# EAGLE design nRF52810_qcaa_dcdc (EAGLE 8.3.0)
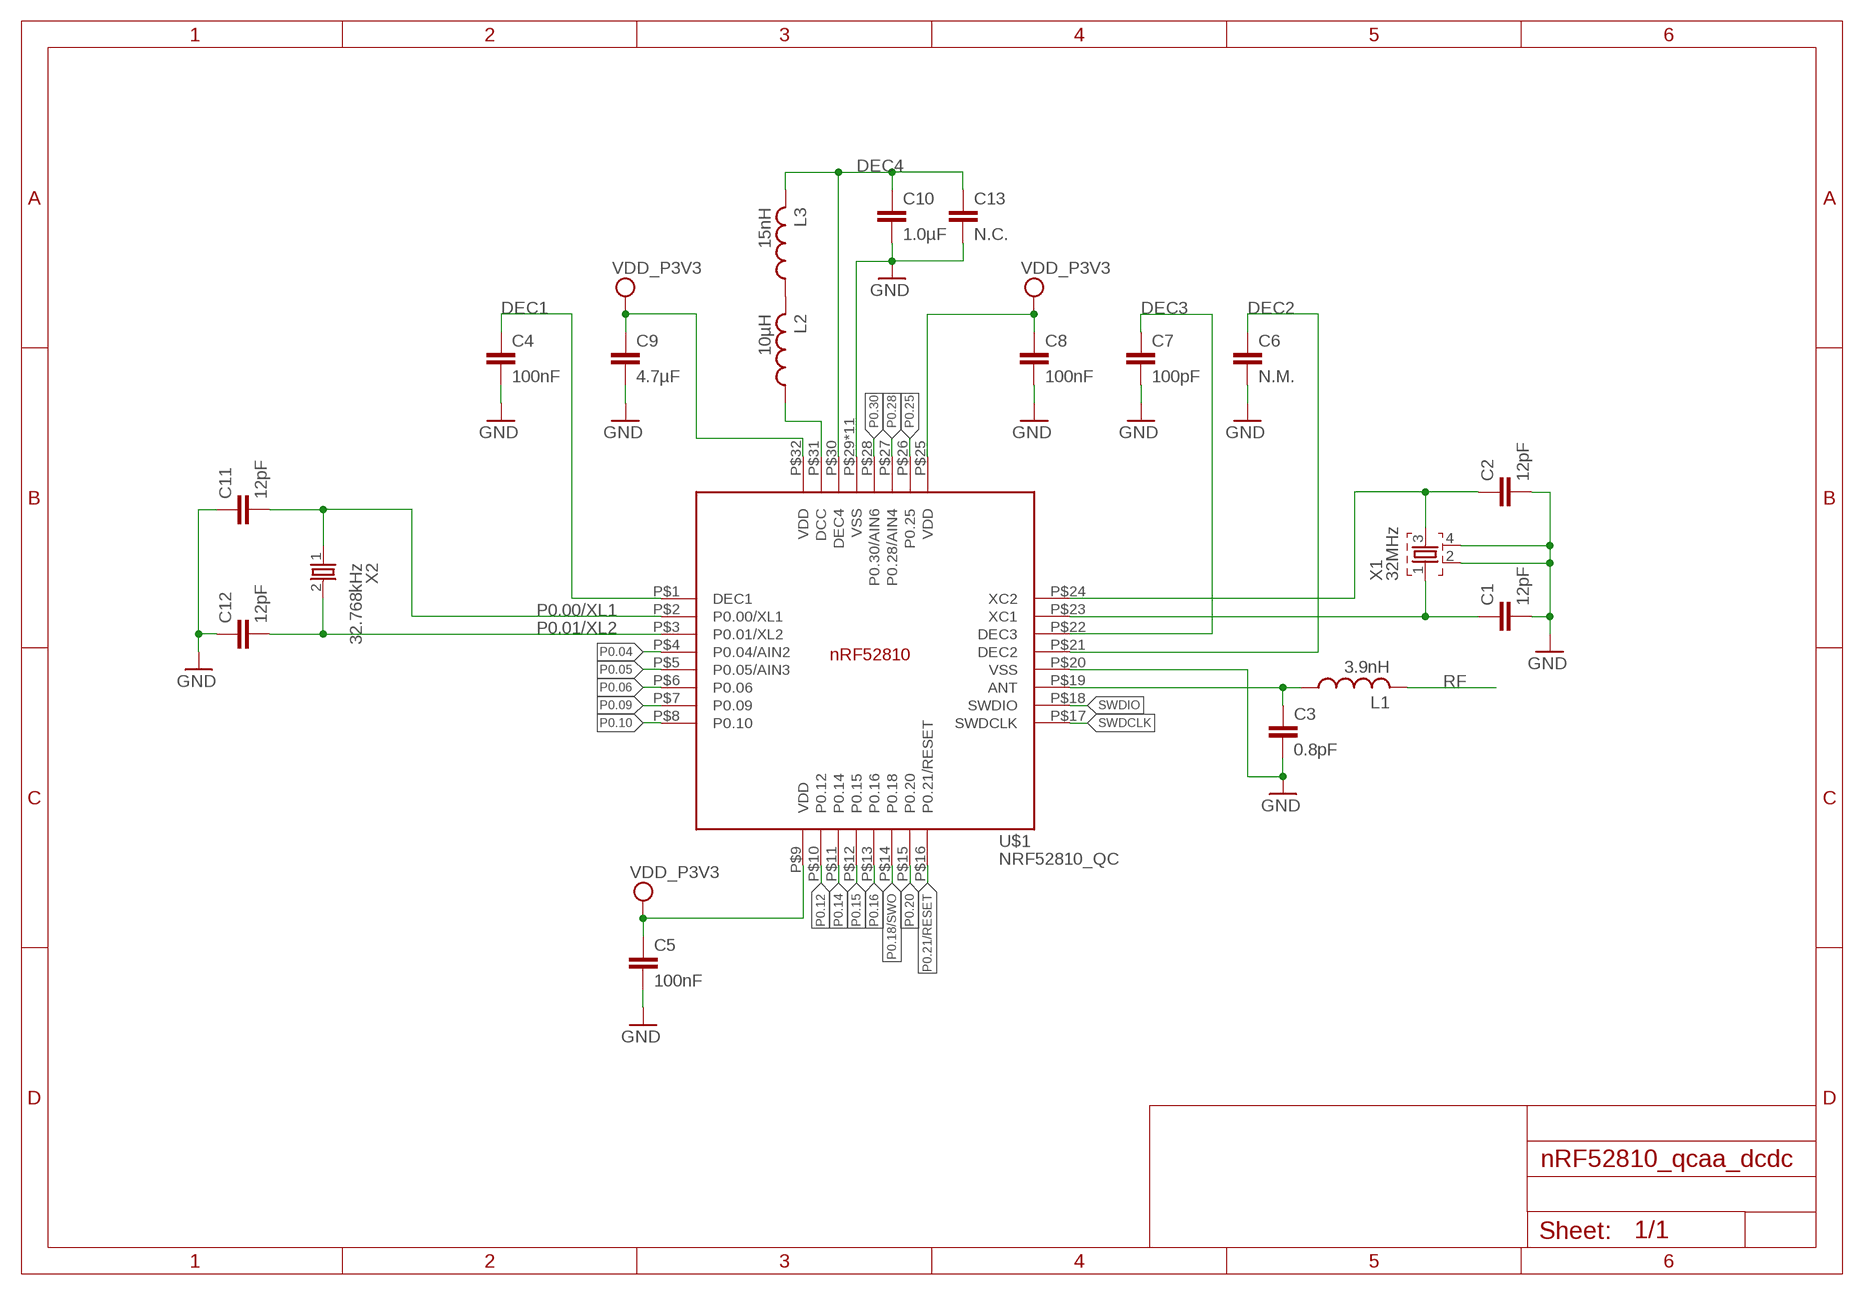
[diagram p0: schematic, sheet 1]

## Parts
C1  12pF  CAPACITOR_0402_N  [RESC0402_N]
C2  12pF  CAPACITOR_0402_N  [RESC0402_N]
C3  0.8pF  CAPACITOR_0402_N  [RESC0402_N]
C4  100nF  CAPACITOR_0402_N  [RESC0402_N]
C5  100nF  CAPACITOR_0402_N  [RESC0402_N]
C6  N.M.  CAPACITOR_0402_N  [RESC0402_N]
C7  100pF  CAPACITOR_0402_N  [RESC0402_N]
C8  100nF  CAPACITOR_0402_N  [RESC0402_N]
C9  4.7µF  CAPACITOR_0603_N  [RESC0603_N]
C10  1.0µF  CAPACITOR_0603_N  [RESC0603_N]
C11  12pF  CAPACITOR_0402_N  [RESC0402_N]
C12  12pF  CAPACITOR_0402_N  [RESC0402_N]
C13  N.C.  CAPACITOR_0402_N  [RESC0402_N]
L1  3.9nH  INDUCTOR_0402_N  [RESC0402_N]
L2  10µH  INDUCTOR_0603_N  [RESC0603_N]
L3  15nH  INDUCTOR_0402_N  [RESC0402_N]
U$1  NRF52810_QC  [QFN50P500X500X90-32_N]
X1  32MHz  XTAL_32MHZ  [BT-XTAL_2016_N]
X2  32.768kHz  XTAL_32KHZ  [XTAL_3215_N]

## Nets
ANT: C3.1 L1.1 U$1.P$19(ANT)
DEC1: C4.1 U$1.P$1(DEC1)
DEC2: C6.1 U$1.P$21(DEC2)
DEC3: C7.1 U$1.P$22(DEC3)
DEC4: C10.1 C13.1 L3.2 U$1.P$30(DEC4)
GND: C1.2 C2.2 C3.2 C4.2 C5.2 C6.2 C7.2 C8.2 C9.2 C10.2 C11.1 C12.1 C13.2 U$1.P$20(VSS) U$1.P$29(VSS) U$1.P$33(VSS) U$1.P$34(VSS) U$1.P$35(VSS) U$1.P$36(VSS) U$1.P$37(VSS) U$1.P$38(VSS) U$1.P$39(VSS) U$1.P$40(VSS) U$1.P$41(VSS) U$1.P$42(VSS) X1.2 X1.4
N$2: L2.2 L3.1
N$3: C2.1 U$1.P$24(XC2) X1.3
N$4: L2.1 U$1.P$31(DCC)
P0.00/XL1: C11.2 U$1.P$2(P0.00/XL1) X2.1
P0.01/XL2: C12.2 U$1.P$3(P0.01/XL2) X2.2
P0.04: U$1.P$4(P0.04/AIN2)
P0.05: U$1.P$5(P0.05/AIN3)
P0.06: U$1.P$6(P0.06)
P0.09: U$1.P$7(P0.09)
P0.10: U$1.P$8(P0.10)
P0.12: U$1.P$10(P0.12)
P0.14: U$1.P$11(P0.14)
P0.15: U$1.P$12(P0.15)
P0.16: U$1.P$13(P0.16)
P0.18/SWO: U$1.P$14(P0.18)
P0.20: U$1.P$15(P0.20)
P0.21/RESET: U$1.P$16(P0.21/RESET)
P0.25: U$1.P$26(P0.25)
P0.28: U$1.P$27(P0.28/AIN4)
P0.30: U$1.P$28(P0.30/AIN6)
RF: L1.2
SWDCLK: U$1.P$17(SWDCLK)
SWDIO: U$1.P$18(SWDIO)
VDD_P3V3: C5.1 C8.1 C9.1 U$1.P$9(VDD) U$1.P$25(VDD) U$1.P$32(VDD)
X1: C1.1 U$1.P$23(XC1) X1.1

## Library data of the parts
C1-C13 = Nordic_nRF:CAPACITOR: Generic chip capacitor
L1-L3 = Nordic_nRF:INDUCTOR: Generic chip inductor
U$1 = Nordic_nRF:NRF52810_QC: nRF52810 Features Single chip, highly flexible, 2.4 GHz multi-protocol SoC 32-bit ARM Cortex-M4 Processor 1.7v to 3.6v operation 192kB flash + 24kB RAM Supports concurrent Bluetooth low energy/ANT protocol operation Up to +4dBm output power -96dBm sensitivity, Bluetooth low energy Thread safe and run-time protected Event driven API On air compatible with nRF24L and nRF24AP series 2 data rates (2Mbps/1Mbps) PPI - maximum flexibility for power-efficient applications and code simplification Automated power management system with automatic power management of each peripheral Configurable I/O mapping for analog and digital I/O 1 x Master/Slave SPI 1 x Two-wire interface (I²C) UART (RTS/CTS) 1 x PWM (4 channels) AES HW encryption 8-channel 10/12-bit ADC Quadrature decoder 64-level analog comparator Real Time Counter (RTC) Digital microphone interface (PDM) On-chip balun Applications Bluetooth 5 connectivity processor Industrial sensors and actuators Wearables SmartHome sensors computer peripherals RF smart remotes Airfuel (A4WP) wireless charging Beacons Sports and fitness sensors Connected health products Smart watches RC Toys Interactive games Building automation
X1 = Nordic_nRF:XTAL_32MHZ
X2 = Nordic_nRF:XTAL_32KHZ

## Board
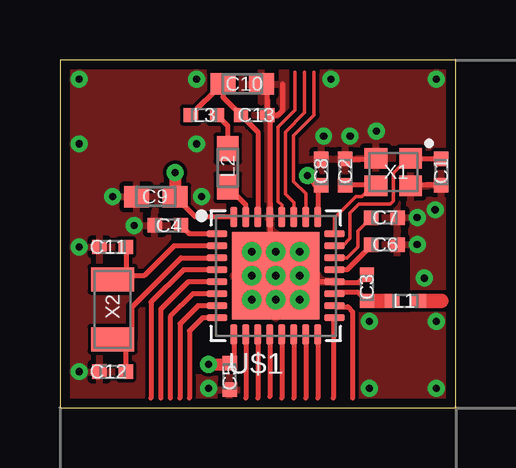
[diagram p1: board, top side]
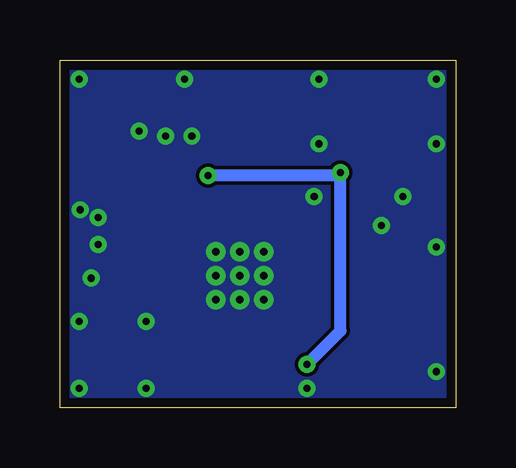
[diagram p2: board, bottom side, seen from below]

Size 16.5 x 14.5 mm. Coordinates in mm from the lower left corner, seen from the top.
Outline: 0,0 16.5,0 16.5,14.5 0,14.5 0,0
Copper layers (1*16): Top 0.035mm / dielectric 1.5mm / Bottom 0.035mm
Design rules "Nordic": minimum track width 0.15mm, minimum drill 0.4mm, track to track 0.15mm, track to pad 0.15mm, pad to pad 0.15mm, via to via 0.15mm, smd to smd 0.15mm, copper to edge 0.4mm, drill to drill 0.4mm, minimum pad ring 10mil, minimum via ring 8mil, stop-mask expansion 4mil, vias tented up to drill 0mil, thermal gap 0.2mm
tRestrict: area 11.8,4 to 14.6,6.3

### Footprints (pad centres in the part's own frame; a part is rotated, then mirrored left to right if it is on the bottom)
RESC0402_N = smd 0.6 x 0.6: 1 -0.55,0; 2 0.55,0
RESC0603_N = smd 1.05 x 0.9: 1 -0.8,0; 2 0.8,0
QFN50P500X500X90-32_N = smd 0.85 x 0.3: P$1 -2.45,1.75; P$2 -2.45,1.25; P$3 -2.45,0.75; P$4 -2.45,0.25; P$5 -2.45,-0.25; P$6 -2.45,-0.75; P$7 -2.45,-1.25; P$8 -2.45,-1.75; P$17 2.45,-1.75; P$18 2.45,-1.25; P$19 2.45,-0.75; P$20 2.45,-0.25; P$21 2.45,0.25; P$22 2.45,0.75; P$23 2.45,1.25; P$24 2.45,1.75 | smd 0.3 x 0.85: P$9 -1.75,-2.45; P$10 -1.25,-2.45; P$11 -0.75,-2.45; P$12 -0.25,-2.45; P$13 0.25,-2.45; P$14 0.75,-2.45; P$15 1.25,-2.45; P$16 1.75,-2.45; P$25 1.75,2.45; P$26 1.25,2.45; P$27 0.75,2.45; P$28 0.25,2.45; P$29 -0.25,2.45; P$30 -0.75,2.45; P$31 -1.25,2.45; P$32 -1.75,2.45 | smd 3.65 x 3.65: P$33 0,0 | drill 0.3 pad 0.6: P$34 -1,1; P$35 0,1; P$36 1,1; P$37 -1,0; P$38 0,0; P$39 1,0; P$40 -1,-1; P$41 0,-1; P$42 1,-1
BT-XTAL_2016_N = smd 0.95 x 0.85: 1 -0.725,-0.575; 2 0.725,-0.575; 3 0.725,0.575; 4 -0.725,0.575
XTAL_3215_N = smd 1 x 1.8: 1 -1.25,0; 2 1.25,0

### Placement (x,y rotation side)
C1  15.9,9.82 270 top
C2  11.9,9.82 90 top
C3  12.8,5 90 top
C4  4.5,7.6 180 top
C5  7.08,1.3 270 top
C6  13.53,6.8 0 top
C7  13.53,7.92 0 top
C8  10.9,9.82 90 top
C9  4,8.8 180 top
C10  7.6,13.5 0 top
C11  2.2,6.7 0 top
C12  2.2,1.5 0 top
C13  8.1,12.2 0 top
L1  14.4,4.45 0 top
L2  7,10 90 top
L3  6,12.2 180 top
U$1  9,5.5 0 top
X1  13.9,9.82 180 top
X2  2.2,4.1 270 top

### Tracks (layer width: path | path; a pad name or v marks a point on that pad's centre or on a via)
ANT
  Top 0.152: 11.5,4.8 U$1.P$19
  Top 0.2: 12.85,4.45 C3.1 12.45,4.8 11.5,4.8
  Top 0.6: L1.1 12.85,4.45
DEC1
  Top 0.2: U$1.P$1 5.4,7.25 C4.1
DEC2
  Top 0.2: C6.1 12.97,6.75 11.97,5.75 U$1.P$21
DEC3
  Top 0.15: U$1.P$22 11.97,6.25 12.43,6.7 12.43,7.38 C7.1
  Top 0.2: C7.1 12.97,7.88
DEC4
  Top 0.2: L3.2 6.75,13.5 C10.1 6.8,12.95 C13.1 8.25,11.5 U$1.P$30
GND  (via drill 0.3 pad 0.6)
  Top 0.152: 11.5,5.2 U$1.P$20
  Top 0.2: C3.2 12.45,5.2 11.5,5.2 | C1.2 14.65,9.28 X1.4 | C2.2 13.15,10.38 X1.2 | 8.75,7.85 U$1.P$29 | 8.75,7.85 8.75,6.5 U$1.P$35 | U$1.P$20 10.25,5.25 arc-90 U$1.P$39 | C13.2 8.75,12.2 8.75,7.85 | C13.2 8.65,13.25 C10.2 | C13.2 9.1,12.2 9.3,12.4 9.3,13.5
  other vias: 0.8,1.5 0.8,6.7 3.1,7.6 11,11.32 14.9,7.92 14.9,6.8 2.2,8.8 15.65,8.25 13.2,11.53 12.1,11.32 0.8,11 6.2,0.8 15.7,3.6 15.2,5.4 5.7,13.7 5.7,11 15.7,13.7 12.9,3.6 15.7,0.8 12.9,0.8 0.8,13.7 11.3,13.7 5.9,8.8
  pour Top: 0,0 0,14.5 16.5,14.5 16.5,0
  pour Bottom: 0,0 0,14.5 16.5,14.5 16.5,0
N$2
  Top 0.2: L2.2 7,11.75 L3.1
N$3
  Top 0.15: X1.3 13.05,9.25 12.6,8.8 12.35,8.8 11.45,7.9 U$1.P$24
  Top 0.2: C2.1 13.1,9.28 13.15,9.28 X1.3
N$4
  Top 0.2: U$1.P$31 7.75,8.45 7.4,8.8 7.1,8.8 L2.1
P0.00/XL1
  Top 0.2: X2.1 2.7,5.45 | C11.2 2.75,5.5 | 2.75,5.5 X2.1 | U$1.P$2 4.75,6.75 3.5,5.5 2.75,5.5 | 2.75,5.5 2.35,5.5 X2.1
P0.01/XL2
  Top 0.2: C12.2 2.75,2.85 X2.2 3,2.85 3,4.2 5.05,6.25 U$1.P$3
P0.04
  Top 0.2: U$1.P$4 5.15,5.75 3.8,4.4 3.8,0.4
P0.05
  Top 0.2: U$1.P$5 5.35,5.25 4.2,4.1 4.2,0.4
P0.06
  Top 0.2: U$1.P$6 5.55,4.75 4.6,3.8 4.6,0.4
P0.09
  Top 0.2: U$1.P$7 5.75,4.25 5,3.5 5,0.4
P0.10
  Top 0.2: U$1.P$8 5.95,3.75 5.4,3.2 5.4,0.4
P0.12
  Top 0.2: U$1.P$10 7.75,0.4
P0.14
  Top 0.2: U$1.P$11 8.25,0.4
P0.15
  Top 0.2: U$1.P$12 8.75,0.45
P0.16
  Top 0.2: U$1.P$13 9.25,0.4
P0.18/SWO
  Top 0.2: U$1.P$14 9.75,0.4
P0.20
  Top 0.2: U$1.P$15 10.25,0.4
P0.21/RESET
  Top 0.2: U$1.P$16 10.75,0.4
P0.25
  Top 0.15: U$1.P$26 10.25,8.93 9.75,9.44 9.75,11.35 10.6,12.2 10.6,14
P0.28
  Top 0.15: U$1.P$27 9.75,8.55 9.4,8.9 9.4,11.5 10.2,12.3 10.2,14
P0.30
  Top 0.15: U$1.P$28 9.25,8.45 9.1,8.6 9.1,11.7 9.8,12.4 9.8,14
RF
  Top 0.6: L1.2 15.9,4.45
SWDCLK
  Top 0.2: 11.4,3.7 arc-90 U$1.P$17 11.4,3.75 11.4,0.4
SWDIO
  Top 0.2: U$1.P$18 arc90 11.5,4.2 12,4.2 12.2,4 12.2,0.4
VDD_P3V3  (via drill 0.3 pad 0.6)
  Top 0.2: U$1.P$25 10.75,9.12 C8.1 10.62,9.28 v10.32,9.68 | U$1.P$9 7.25,2.02 arc-90 C5.1 | C9.1 5.45,8.15 5.65,7.95 U$1.P$32
  Top 0.5: v4.8,9.8 C9.1 | v6.2,1.8 7.08,1.8 C5.1
  Bottom 0.5: v6.2,1.8 4.8,3.2 v4.8,9.8 arc90 4.92,9.68 v10.32,9.68
X1
  Top 0.15: X1.1 14.53,10.4 13.9,9.78 13.9,8.62 13.78,8.5 12.47,8.5 12.1,8.12 12.1,7.05 11.8,6.75 U$1.P$23
  Top 0.2: C1.1 14.65,10.38 X1.1